# Altium schematic sheet connect.SchDoc
size A4
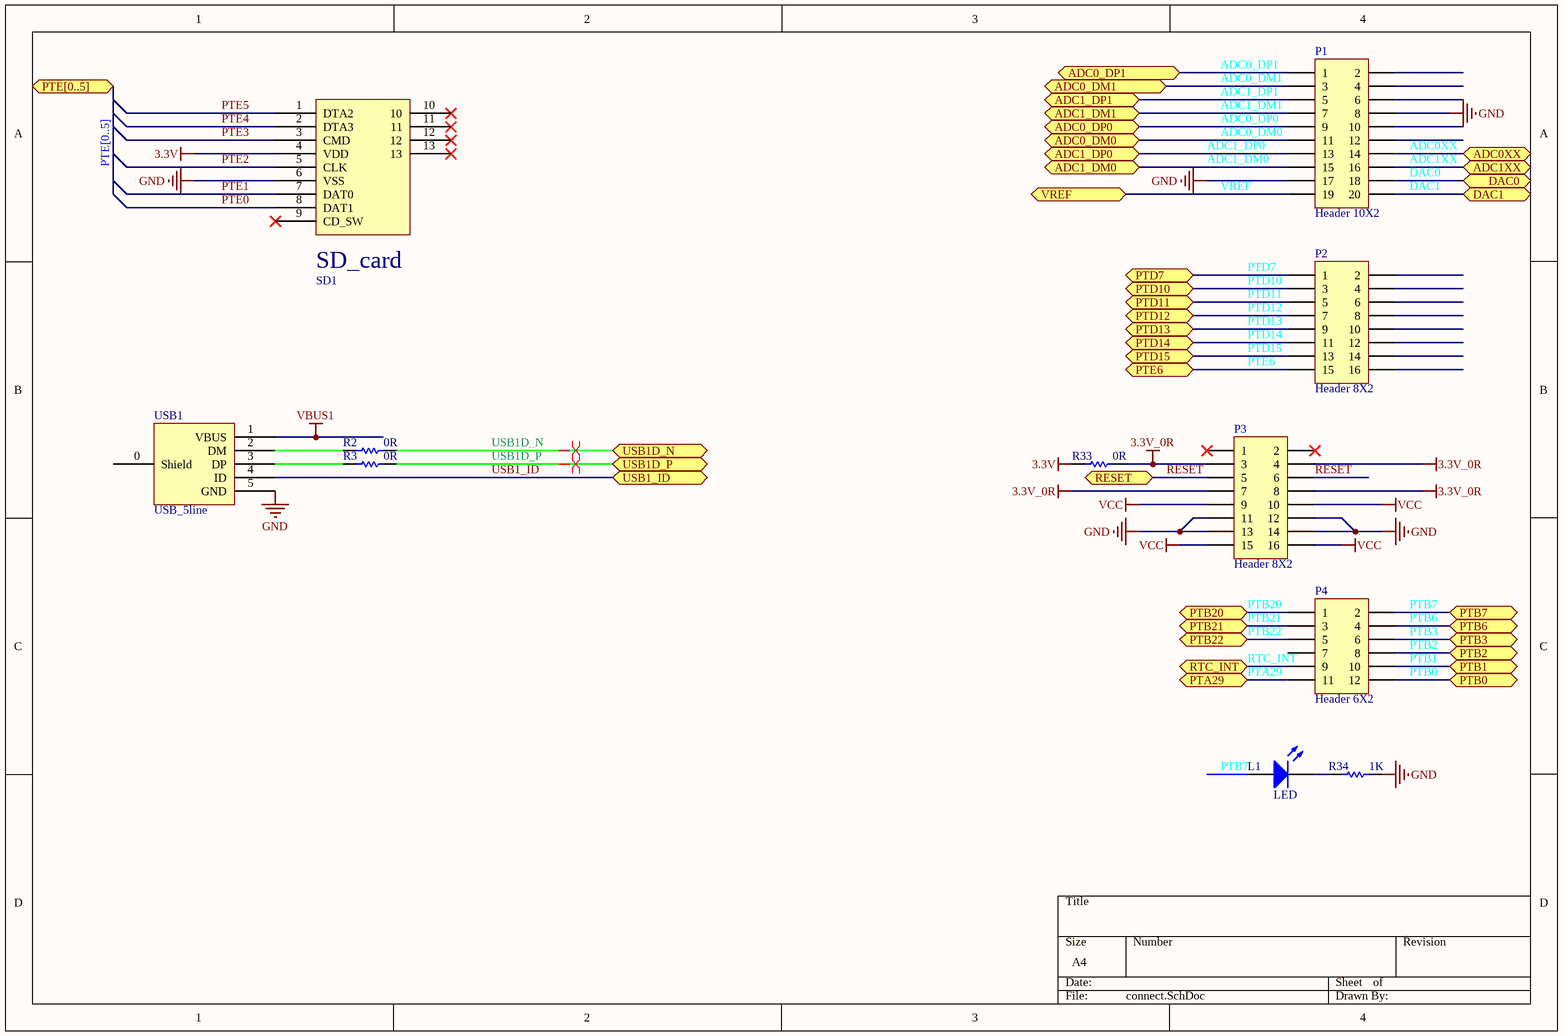
[diagram p0: connect.SchDoc]

## Parts
L1  LED  [1608[0603]]
P1  Header 10X2  [HDR2X10]
P2  Header 8X2  [HDR2X8]
P3  Header 8X2  [HDR2X8]
P4  Header 6X2  [HDR2X6]
R2  value 0R  [1608[0603]]  (hidden comment: Res)
R3  value 0R  [1608[0603]]  (hidden comment: Res)
R33  value 0R  [1206]  (hidden comment: Res)
R34  value 1K  [1608[0603]]  (hidden comment: Res)
SD1  TF_card  [TF卡座(短体)]  (value not drawn)
USB1  USB_5line  [USB-MICRO-5P-2F]

## Ports
ADC0_DM0, ADC0_DM1, ADC0_DP0, ADC0_DP1, ADC0XX, ADC1_DM0, ADC1_DM1, ADC1_DP0, ADC1_DP1, ADC1XX, DAC0, DAC1, PTA29, PTB0, PTB1, PTB2, PTB3, PTB6, PTB7, PTB20, PTB21, PTB22, PTD7, PTD10, PTD11, PTD12, PTD13, PTD14, PTD15, PTE6, PTE[0..5], RESET, RTC_INT, USB1_ID, USB1D_N, USB1D_P, VREF

## Nets
3.3V: R33.2 SD1.4(VDD)
3.3V_0R: P3.3 P3.4 P3.7 P3.8 R33.1
GND: P1.8 P1.17 P3.11 P3.12 P3.13 P3.14 R34.1 SD1.6(VSS) USB1.5(GND)
VBUS1: USB1.1(VBUS)
VCC: P3.9 P3.10 P3.15 P3.16
ADC0_DM0: P1.11 ; port ADC0_DM0
ADC0_DM1: P1.3 ; port ADC0_DM1
ADC0_DP0: P1.9 ; port ADC0_DP0
ADC0_DP1: P1.1 ; port ADC0_DP1
ADC0XX: P1.14 ; port ADC0XX
ADC1_DM0: P1.15 ; port ADC1_DM0
ADC1_DM1: P1.7 ; port ADC1_DM1
ADC1_DP0: P1.13 ; port ADC1_DP0
ADC1_DP1: P1.5 ; port ADC1_DP1
ADC1XX: P1.16 ; port ADC1XX
DAC0: P1.18 ; port DAC0
DAC1: P1.20 ; port DAC1
PTA29: P4.11 ; port PTA29
PTB0: P4.12 ; port PTB0
PTB1: P4.10 ; port PTB1
PTB2: P4.8 ; port PTB2
PTB3: P4.6 ; port PTB3
PTB6: P4.4 ; port PTB6
PTB7: L1.1(A) P4.2 ; port PTB7
PTB20: P4.1 ; port PTB20
PTB21: P4.3 ; port PTB21
PTB22: P4.5 ; port PTB22
PTD7: P2.1 ; port PTD7
PTD10: P2.3 ; port PTD10
PTD11: P2.5 ; port PTD11
PTD12: P2.7 ; port PTD12
PTD13: P2.9 ; port PTD13
PTD14: P2.11 ; port PTD14
PTD15: P2.13 ; port PTD15
PTE0: SD1.8(DAT1)
PTE1: SD1.7(DAT0)
PTE2: SD1.5(CLK)
PTE3: SD1.3(CMD)
PTE4: SD1.2(DTA3)
PTE5: SD1.1(DTA2)
PTE6: P2.15 ; port PTE6
RESET: P3.5 P3.6 ; port RESET
RTC_INT: P4.9 ; port RTC_INT
USB1_ID: USB1.4(ID) ; port USB1_ID
USB1D_N: R2.1 ; port USB1D_N
USB1D_P: R3.1 ; port USB1D_P
VREF: P1.19 ; port VREF
NetL1_2: L1.2(K) R34.2
NetR2_2: R2.2 USB1.2(DM)
NetR3_2: R3.2 USB1.3(DP)

Not connected (* = marked no-connect by the designer): P1 2 4 6 10 12; P2 2 4 6 8 10 12 14 16; P3 1* 2*; P4 7; SD1 9(CD_SW)* 10* 11* 12* 13*; USB1 0(Shield)

## Buses and harness runs
bus PTE[0..5] = port PTE[0..5]

## Layout directives
differential pair: USB1D_N, USB1D_P

## Notes on the sheet
- (in symbol TF_card) SD_card

## Library data of the parts
P1 = Header 10X2: Header, 10-Pin, Dual row; LatestRevisionDate: 17-Jul-2002; LatestRevisionNote: Re-released for DXP Platform.; Publisher: Altium Limited
P2 P3 = Header 8X2: Header, 8-Pin, Dual row; LatestRevisionDate: 17-Jul-2002; LatestRevisionNote: Re-released for DXP Platform.; Publisher: Altium Limited
P4 = Header 6X2: Header, 6-Pin, Dual row; LatestRevisionDate: 17-Jul-2002; LatestRevisionNote: Re-released for DXP Platform.; Publisher: Altium Limited
R2 R3 R33 R34 = Res: 贴片电阻; Published: 8-Jun-2000; LatestRevisionDate: 17-Jul-2002; LatestRevisionNote: Re-released for DXP Platform.; PackageReference: AXIAL-0.3; Publisher: Altium Limited